# EAGLE design button board (EAGLE 7.1.0)
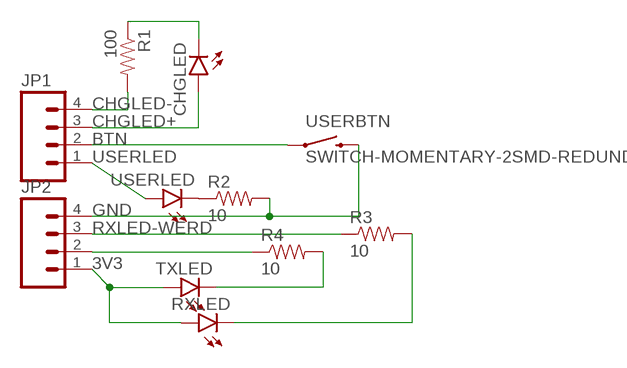
[diagram p0: schematic, sheet 1]

## Parts
CHGLED  LED-FKIT-1206  [FKIT-LED-1206]
JP1  M04PTH  [1X04]
JP2  M04PTH  [1X04]
R1  100  RESISTOR0603-RES  [0603-RES]
R2  10  RESISTOR0603-RES  [0603-RES]
R3  10  RESISTOR0603-RES  [0603-RES]
R4  10  RESISTOR0603-RES  [0603-RES]
RXLED  LED-FKIT-1206  [FKIT-LED-1206]
TXLED  LED-FKIT-1206  [FKIT-LED-1206]
USERBTN  SWITCH-MOMENTARY-2SMD-REDUNDANT  [TACTILE-SWITCH-SMD]
USERLED  LED-FKIT-1206  [FKIT-LED-1206]

## Nets
3V3: JP2.1 RXLED.A TXLED.A
BTN: JP1.2 USERBTN.1 USERBTN.2
CHGLED+: CHGLED.A JP1.3
CHGLED-: JP1.4 R1.2
GND: JP2.4 R2.2 USERBTN.3 USERBTN.4
N$1: CHGLED.C R1.1
N$3: R2.1 USERLED.C
RXLED-: JP2.3 R3.1
RXLED-WERD: R3.2 RXLED.C
TXLED-: JP2.2 R4.1
TXLED-WERD: R4.2 TXLED.C
USERLED: JP1.1 USERLED.A

## Library data of the parts
CHGLED RXLED TXLED USERLED = SparkFun-LED:LED: LEDs Standard schematic elements and footprints for 5mm, 3mm, 1206, and 0603 sized LEDs. 5mm - Spark Fun Electronics SKU : COM-00529 (and others)
JP1 JP2 = SparkFun-Connectors:M04: Header 4 Standard 4-pin 0.1" header. Use with straight break away headers (SKU : PRT-00116), right angle break away headers (PRT-00553), swiss pins (PRT-00743), machine pins (PRT-00117), and female headers (PRT-00115). Molex polarized connector foot print use with SKU : PRT-08231 with associated crimp pins and housings. 1MM SMD Version SKU: PRT-10208
R1-R4 = SparkFun-Passives:RESISTOR: Resistor Basic schematic elements and footprints for 0603, 1206, and PTH resistors.
USERBTN = SparkFun-Electromechanical:SWITCH-MOMENTARY-2: Various NO switches- pushbuttons, reed, etc; PROD_ID: SWCH-08247

## Board
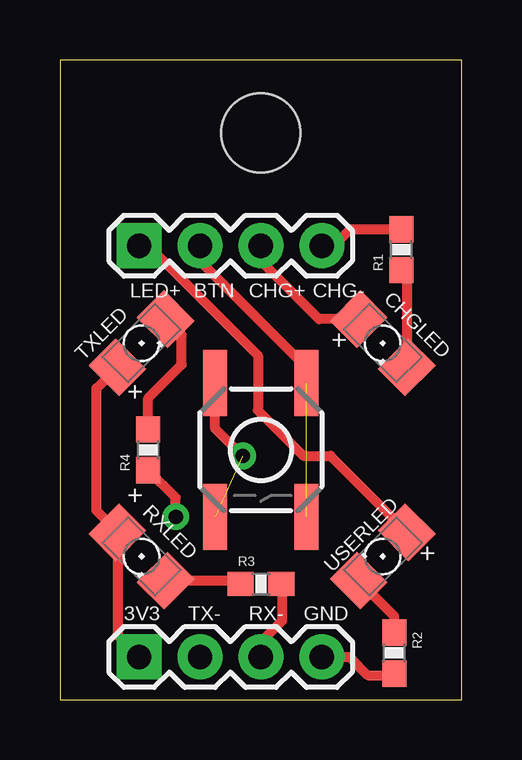
[diagram p1: board, top side]
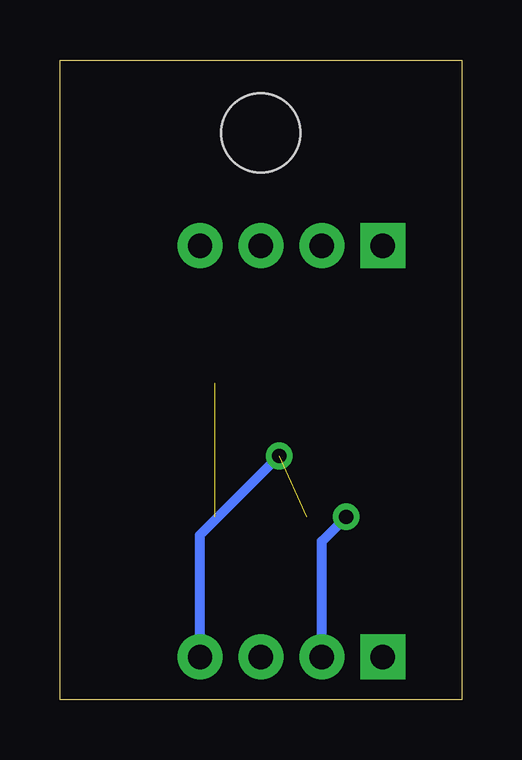
[diagram p2: board, bottom side, seen from below]

Size 16.76 x 26.67 mm. Coordinates in mm from the lower left corner, seen from the top.
Outline: 0,0 16.76,0 16.76,26.67 0,26.67 0,0
Copper layers (1*16): Top 0.035mm / dielectric 1.5mm / Bottom 0.035mm
Design rules "SparkFun": minimum track width 8mil, minimum drill 20mil, track to track 8mil, track to pad 8mil, pad to pad 8mil, via to via 8mil, smd to smd 8mil, copper to edge 10mil, drill to drill 8mil, minimum pad ring 12mil, minimum via ring 10mil, stop-mask expansion 4mil, vias tented up to drill 25mil, thermal gap 10mil

### Footprints (pad centres in the part's own frame; a part is rotated, then mirrored left to right if it is on the bottom)
FKIT-LED-1206 = smd 1.6 x 1.803: A -1.422,0; C 1.422,0
1X04 = drill 1.016 pad 1.88 square: 1 0,0 | drill 1.016 pad 1.88: 2 2.54,0; 3 5.08,0; 4 7.62,0
0603-RES = smd 1.1 x 1: 1 -0.85,0; 2 0.85,0
STAND-OFF = hole 3.302: 0,0
TACTILE-SWITCH-SMD = smd 2.75 x 1: 1 -2.794,1.905; 2 2.794,1.905; 3 -2.794,-1.905; 4 2.794,-1.905

### Placement (x,y rotation side)
CHGLED  13.46,14.86 315 top
JP1  3.3,18.92 0 top
JP2  3.3,1.78 0 top
R1  14.24,18.76 90 top
R2  13.94,1.94 270 top
R3  8.38,4.83 180 top
R4  3.68,10.41 90 top
RXLED  3.4,5.97 315 top
TXLED  3.4,14.86 45 top
U$1  [STAND-OFF]  8.38,23.62 0 top
USERBTN  8.38,10.41 270 top
USERLED  13.46,5.97 225 top

### Tracks (layer width: path | path; a pad name or v marks a point on that pad's centre or on a via)
3V3
  Top 0.406: 2.03,14.22 TXLED.A 1.52,12.98 1.52,7.87 2.4,7 RXLED.A 2.4,2.68 JP2.1
BTN  (1 unrouted)
  Top 0.406: USERBTN.1 10.16,13.34 10.16,13.97 5.84,18.29 JP1.2
CHGLED+
  Top 0.406: CHGLED.A 10.8,15.87 8.38,18.29 JP1.3
CHGLED-
  Top 0.406: R1.2 12.12,19.61 11.43,18.92 JP1.4
GND  (via drill 0.6)  (1 unrouted)
  Top 0.406: JP2.4 12.06,1.78 12.83,1.02 13.86,1.02 R2.2 | v7.62,10.16 6.48,11.3 USERBTN.3
  Bottom 0.406: JP2.4 10.92,6.86 v7.62,10.16
N$1
  Top 0.406: R1.1 14.47,17.68 CHGLED.C
N$3
  Top 0.406: R2.1 13.94,3.48 USERLED.C
RXLED-
  Top 0.406: JP2.3 8.38,2.41 9.27,3.3 9.27,4.79 R3.1
RXLED-WERD
  Top 0.406: RXLED.C 7.39,4.96 R3.2
TXLED-  (via drill 0.6)
  Top 0.406: v4.83,7.62 4.83,8.42 R4.1
  Bottom 0.406: JP2.2 5.84,6.6 v4.83,7.62
TXLED-WERD
  Top 0.406: R4.2 3.68,12.57 5.08,13.97 5.08,15.19 TXLED.C
USERLED
  Top 0.406: USERLED.A 11.28,10.16 10.16,10.16 8.26,12.06 8.26,14.35 3.68,18.92 JP1.1

### Text on the board
tPlace: LED+ | BTN | CHG+ | CHG- | + | + | + | + | 3V3 | TX- | RX- | GND